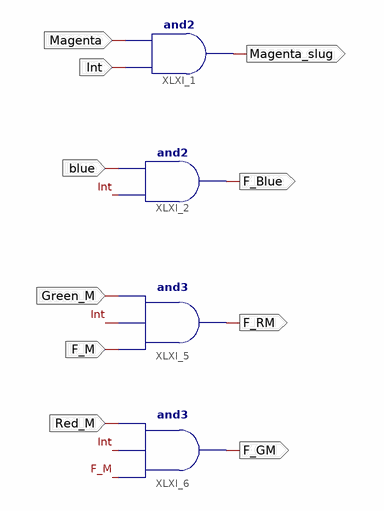
[diagram p0: schematic sheet 1]
// Xilinx ISE schematic Flash.sch (spartan3e) as structural Verilog: 4 symbols, 10 ports
module Flash (
  input  Int,
  input  Magenta,
  input  blue,
  input  Green_M,
  input  Red_M,
  input  F_M,
  output Magenta_slug,
  output F_Blue,
  output F_GM,
  output F_RM
);

  and XLXI_1 (Magenta_slug, Int, Magenta);
  and XLXI_2 (F_Blue, Int, blue);
  and XLXI_5 (F_RM, F_M, Int, Green_M);
  and XLXI_6 (F_GM, F_M, Int, Red_M);
endmodule
